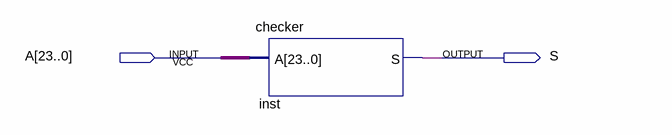
[diagram p0: schematic sheet]
// Quartus schematic checker_bdf.bdf as structural Verilog: 1 symbols, 2 pins
module checker_bdf (
  input  [23:0] A,
  output S
);

  \checker  inst (.A(A), .S(S));
endmodule
